# Altium schematic sheet 电源.SchDoc
size A4
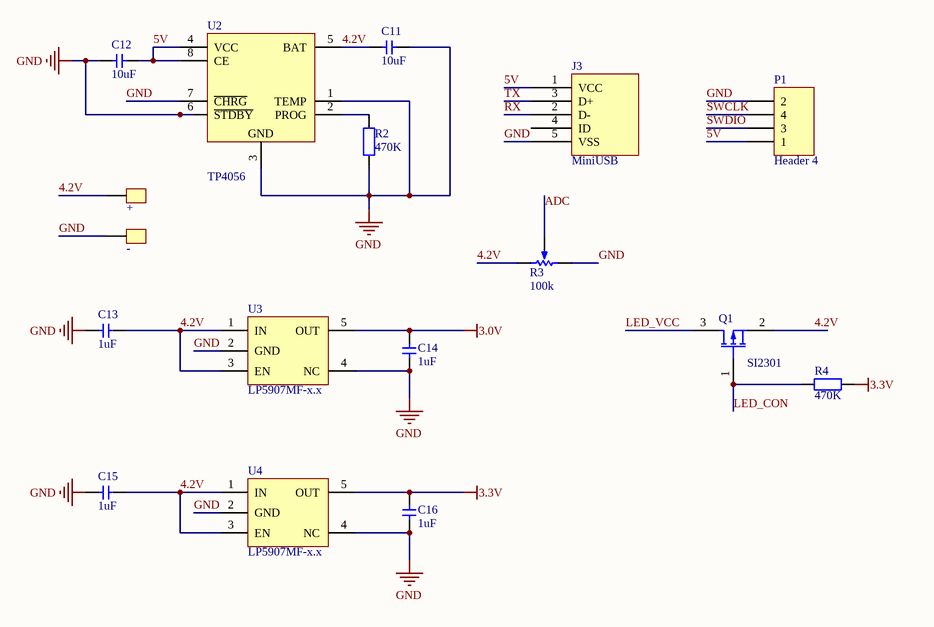
[diagram p0: 电源.SchDoc]

## Parts
+  pad  [pad_3x3]  (value not drawn)
-  pad  [pad_3x3]  (value not drawn)
C11  value 10uF  [0805-2]  (hidden comment: Cap)
C12  value 10uF  [0805-2]  (hidden comment: Cap)
C13  value 1uF  [0805-2]  (hidden comment: Cap)
C14  value 1uF  [0805-2]  (hidden comment: Cap)
C15  value 1uF  [0805-2]  (hidden comment: Cap)
C16  value 1uF  [0805-2]  (hidden comment: Cap)
J3  MiniUSB  [MINI USB]
P1  Header 4  [HDR1X4]
Q1  SI2301  [SOT-23]
R2  value 470K  [0805-2]  (hidden comment: Res1)
R3  value 100k  [3362P]  (hidden comment: 3362)
R4  value 470K  [0805-2]  (hidden comment: Res1)
U2  TP4056  [SOP-8-PP]
U3  LP5907MF-x.x  [SOT-23-5]
U4  LP5907MF-x.x  [SOT-23-5]

## Nets
3.0V: C14.2 U3.5(OUT)
3.3V: C16.2 R4.1 U4.5(OUT)
GND: -.1 C11.1 C12.2 C13.2 C14.1 C15.2 C16.1 J3.5(VSS) P1.2 R2.1 R3.1(TOP) U2.1(TEMP) U2.3(GND) U2.6(~{STDBY}) U2.7(~{CHRG}) U3.2(GND) U3.4(NC) U4.2(GND) U4.4(NC)
4.2V: +.1 C11.2 C13.1 C15.1 Q1.2(S) R3.3(BOT) U2.5(BAT) U3.1(IN) U3.3(EN) U4.1(IN) U4.3(EN)
5V: C12.1 J3.1(VCC) P1.1 U2.4(VCC) U2.8(CE)
ADC: R3.2(TAP)
LED_CON: Q1.1(G) R4.2
LED_VCC: Q1.3(D)
RX: J3.2(D-)
SWCLK: P1.4
SWDIO: P1.3
TX: J3.3(D+)
NetR2_2: R2.2 U2.2(PROG)

Not connected (* = marked no-connect by the designer): J3 4(ID)

## Library data of the parts
+ - = pad_3x3: 焊盘接口
C11-C16 = Cap: 无极性电容; Published: 8-Jun-2000; LatestRevisionDate: 17-Jul-2002; LatestRevisionNote: Re-released for DXP Platform.; PackageReference: RAD-0.3; Publisher: Altium Limited
J3 = MiniUSB: MiniUSB母座
P1 = Header 4: Header, 4-Pin; LatestRevisionDate: 17-Jul-2002; LatestRevisionNote: Re-released for DXP Platform.; Publisher: Altium Limited
Q1 = SI2301: PMOS
R2 R4 = Res1: 贴片电阻; Published: 8-Jun-2000; LatestRevisionDate: 17-Jul-2002; LatestRevisionNote: Re-released for DXP Platform.; PackageReference: AXIAL-0.4; Publisher: Altium Limited
R3 = 3362: 精密可调单圈电阻器
U2 = TP4056: 锂电池充电管理
U3 U4 = LP5907MF-x.x: LDO线性稳压器